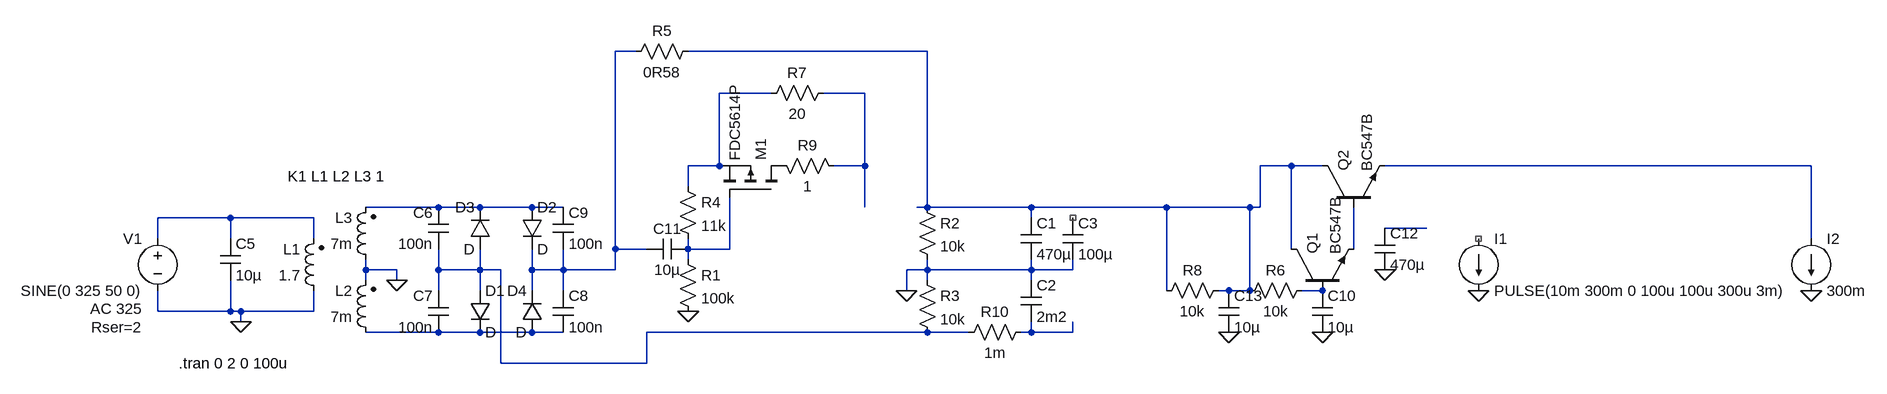
[diagram p0: schematic power_supply.asc]
power_supply.asc, the LTspice schematic file:
Version 4
SHEET 1 2892 680
WIRE 576 -192 544 -192
WIRE 1024 -192 656 -192
WIRE 784 -128 704 -128
WIRE 928 -128 864 -128
WIRE 704 -16 704 -128
WIRE 704 -16 656 -16
WIRE 928 -16 928 -128
WIRE 928 -16 880 -16
WIRE 1584 -16 1536 -16
WIRE 1632 -16 1584 -16
WIRE 2384 -16 1728 -16
WIRE 656 16 656 -16
WIRE 272 48 160 48
WIRE 336 48 272 48
WIRE 416 48 336 48
WIRE 464 48 416 48
WIRE 928 48 928 -16
WIRE 1024 48 1024 -192
WIRE 1024 48 1008 48
WIRE 1184 48 1024 48
WIRE 1392 48 1184 48
WIRE 1520 48 1392 48
WIRE 1536 48 1536 -16
WIRE 1536 48 1520 48
WIRE -48 64 -160 64
WIRE 80 64 -48 64
WIRE 1184 64 1184 48
WIRE 1792 80 1728 80
WIRE -160 96 -160 64
WIRE -48 96 -48 64
WIRE 80 96 80 64
WIRE 2384 96 2384 -16
WIRE 544 112 544 -192
WIRE 592 112 544 112
WIRE 656 112 656 96
WIRE 720 112 720 32
WIRE 720 112 656 112
WIRE 1584 112 1584 -16
WIRE 1680 112 1680 48
WIRE 656 128 656 112
WIRE 160 144 160 128
WIRE 208 144 160 144
WIRE 272 144 272 112
WIRE 336 144 336 112
WIRE 336 144 272 144
WIRE 368 144 336 144
WIRE 416 144 416 112
WIRE 464 144 464 112
WIRE 464 144 416 144
WIRE 544 144 544 112
WIRE 544 144 464 144
WIRE 1024 144 1024 128
WIRE 1024 144 992 144
WIRE 1184 144 1184 128
WIRE 1184 144 1024 144
WIRE 1248 144 1248 128
WIRE 1248 144 1184 144
WIRE 160 160 160 144
WIRE 208 160 208 144
WIRE 1024 160 1024 144
WIRE 1184 160 1184 144
WIRE 272 176 272 144
WIRE 336 176 336 144
WIRE 416 176 416 144
WIRE 464 176 464 144
WIRE 992 176 992 144
WIRE 1392 176 1392 48
WIRE 1488 176 1472 176
WIRE 1520 176 1520 48
WIRE 1520 176 1488 176
WIRE 1632 176 1600 176
WIRE -160 208 -160 176
WIRE -48 208 -48 160
WIRE -48 208 -160 208
WIRE -32 208 -48 208
WIRE 80 208 80 176
WIRE 80 208 -32 208
WIRE -32 224 -32 208
WIRE 272 240 160 240
WIRE 336 240 272 240
WIRE 416 240 336 240
WIRE 464 240 416 240
WIRE 1024 240 592 240
WIRE 1088 240 1024 240
WIRE 1184 240 1184 224
WIRE 1184 240 1168 240
WIRE 1248 240 1248 224
WIRE 1248 240 1184 240
WIRE 368 288 368 144
WIRE 592 288 592 240
WIRE 592 288 368 288
FLAG -32 224 0
FLAG 992 176 0
FLAG 208 160 0
FLAG 656 208 0
FLAG 1632 240 0
FLAG 1872 176 0
FLAG 1728 144 0
FLAG 1488 240 0
FLAG 2384 176 0
SYMBOL ind2 96 192 R180
WINDOW 0 36 80 Left 2
WINDOW 3 36 40 Left 2
SYMATTR InstName L1
SYMATTR Value 1.7
SYMATTR Type ind
SYMATTR SpiceLine Rser=100
SYMBOL ind2 176 256 R180
WINDOW 0 36 80 Left 2
WINDOW 3 36 40 Left 2
SYMATTR InstName L2
SYMATTR Value 7m
SYMATTR Type ind
SYMATTR SpiceLine Rser=0.6
SYMBOL voltage -160 80 M0
WINDOW 123 24 124 Left 2
WINDOW 39 24 152 Left 2
SYMATTR Value2 AC 325
SYMATTR SpiceLine Rser=2
SYMATTR InstName V1
SYMATTR Value SINE(0 325 50 0)
SYMBOL ind2 176 144 R180
WINDOW 0 36 80 Left 2
WINDOW 3 36 40 Left 2
SYMATTR InstName L3
SYMATTR Value 7m
SYMATTR Type ind
SYMATTR SpiceLine Rser=0.6
SYMBOL res 1008 32 R0
SYMATTR InstName R2
SYMATTR Value 10k
SYMBOL res 1008 144 R0
SYMATTR InstName R3
SYMATTR Value 10k
SYMBOL diode 320 176 R0
SYMATTR InstName D1
SYMBOL diode 400 48 R0
SYMATTR InstName D2
SYMBOL diode 352 112 R180
WINDOW 0 24 64 Left 2
WINDOW 3 24 0 Left 2
SYMATTR InstName D3
SYMBOL diode 432 240 R180
WINDOW 0 24 64 Left 2
WINDOW 3 24 0 Left 2
SYMATTR InstName D4
SYMBOL cap 1168 64 R0
SYMATTR InstName C1
SYMATTR Value 470µ
SYMATTR SpiceLine Rser=100m Lser=20n
SYMBOL cap 1168 160 R0
SYMATTR InstName C2
SYMATTR Value 2m2
SYMATTR SpiceLine Rser=100m Lser=20n
SYMBOL cap 1232 64 R0
SYMATTR InstName C3
SYMATTR Value 100µ
SYMATTR SpiceLine Rser=30m
SYMBOL res 784 -32 M90
WINDOW 0 0 56 VBottom 2
WINDOW 3 32 56 VTop 2
SYMATTR InstName R9
SYMATTR Value 1
SYMBOL res 1184 224 R90
WINDOW 0 0 56 VBottom 2
WINDOW 3 32 56 VTop 2
SYMATTR InstName R10
SYMATTR Value 1m
SYMBOL cap -64 96 R0
SYMATTR InstName C5
SYMATTR Value 10µ
SYMBOL cap 288 48 M0
SYMATTR InstName C6
SYMATTR Value 100n
SYMBOL cap 288 176 M0
SYMATTR InstName C7
SYMATTR Value 100n
SYMBOL cap 448 48 R0
SYMATTR InstName C9
SYMATTR Value 100n
SYMBOL cap 448 176 R0
SYMATTR InstName C8
SYMATTR Value 100n
SYMBOL pmos 800 32 M270
SYMATTR InstName M1
SYMATTR Value FDC5614P
SYMBOL cap 592 128 R270
WINDOW 0 32 32 VTop 2
WINDOW 3 0 32 VBottom 2
SYMATTR InstName C11
SYMATTR Value 10µ
SYMBOL res 640 112 R0
SYMATTR InstName R1
SYMATTR Value 100k
SYMBOL res 768 -112 R270
WINDOW 0 32 56 VTop 2
WINDOW 3 0 56 VBottom 2
SYMATTR InstName R7
SYMATTR Value 20
SYMBOL res 640 0 R0
SYMATTR InstName R4
SYMATTR Value 11k
SYMBOL res 672 -208 R90
WINDOW 0 0 56 VBottom 2
WINDOW 3 32 56 VTop 2
SYMATTR InstName R5
SYMATTR Value 0R58
SYMBOL res 1616 160 R90
WINDOW 0 0 56 VBottom 2
WINDOW 3 32 56 VTop 2
SYMATTR InstName R6
SYMATTR Value 10k
SYMBOL cap 1616 176 R0
SYMATTR InstName C10
SYMATTR Value 10µ
SYMBOL npn 1584 176 R270
SYMATTR InstName Q1
SYMATTR Value BC547B
SYMBOL current 1872 96 R0
WINDOW 123 0 0 Left 0
WINDOW 39 0 0 Left 0
SYMATTR InstName I1
SYMATTR Value PULSE(10m 300m 0 100u 100u 300u 3m)
SYMBOL cap 1712 80 R0
SYMATTR InstName C12
SYMATTR Value 470µ
SYMBOL res 1488 160 R90
WINDOW 0 0 56 VBottom 2
WINDOW 3 32 56 VTop 2
SYMATTR InstName R8
SYMATTR Value 10k
SYMBOL cap 1472 176 R0
SYMATTR InstName C13
SYMATTR Value 10µ
SYMBOL current 2384 96 R0
WINDOW 123 0 0 Left 0
WINDOW 39 0 0 Left 0
SYMATTR InstName I2
SYMATTR Value 300m
SYMBOL npn 1632 48 R270
SYMATTR InstName Q2
SYMATTR Value BC547B
TEXT 40 0 Left 2 !K1 L1 L2 L3 1
TEXT -128 288 Left 2 !.tran 0 2 0 100u

The netlist it stands for:
* power_supply.asc
L1 0 N007 1.7 Rser=100
L2 N013 0 7m Rser=0.6
V1 N007 0 SINE(0 325 50 0) AC 325 Rser=2
L3 0 N006 7m Rser=0.6
R2 N002 0 10k
R3 0 N011 10k
D1 N011 N013 D
D2 N006 N001 D
D3 N011 N006 D
D4 N013 N001 D
C1 N002 0 470µ Rser=100m Lser=20n
C2 0 N014 2m2 Rser=100m Lser=20n
C3 NC_01 0 100µ Rser=30m
R9 P001 N004 1
R10 N014 N011 1m
C5 N007 0 10µ
C6 N006 N011 100n
C7 N011 N013 100n
C9 N006 N001 100n
C8 N001 N013 100n
M1 P001 N009 N003 N003 FDC5614P
C11 N001 N009 10µ
R1 N009 0 100k
R7 N003 N004 20
R4 N003 N009 11k
R5 N002 N001 0R58
R6 N012 N002 10k
C10 N012 0 10µ
Q1 N002 N012 N010 0 BC547B
I1 NC_02 0 PULSE(10m 300m 0 100u 100u 300u 3m)
C12 N008 0 470µ
R8 N002 N002 10k
C13 N002 0 10µ
I2 N005 0 300m
Q2 N002 N010 N005 0 BC547B
.model D D
.lib standard.dio
.model NPN NPN
.model PNP PNP
.lib standard.bjt
.model NMOS NMOS
.model PMOS PMOS
.lib standard.mos
K1 L1 L2 L3 1
.tran 0 2 0 100u
.backanno
.end